# EAGLE design invader-rgb_working (EAGLE 7.5.0)
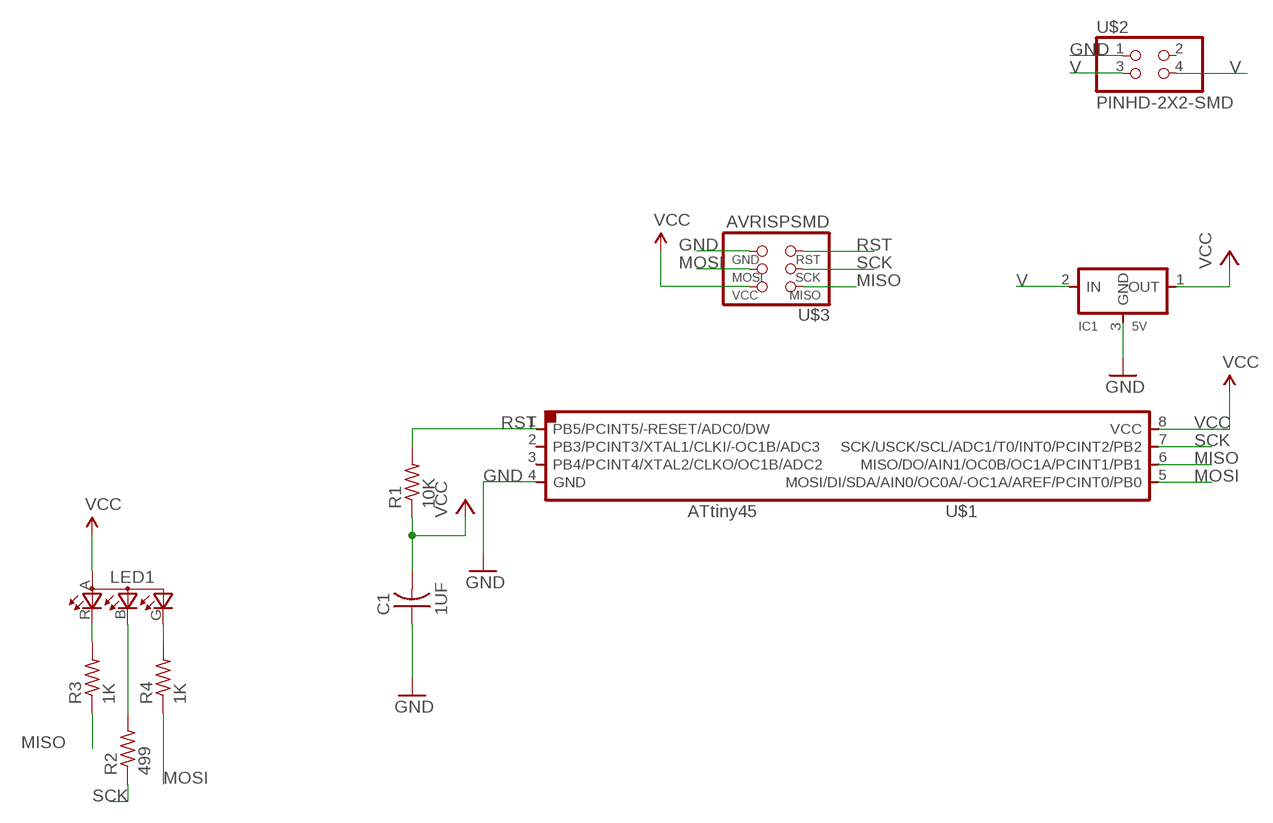
[diagram p0: schematic, sheet 1]

## Parts
C1  1UF  CAP-US1206FAB  [C1206FAB]
IC1  5V  REGULATORSOT23  [SOT23]
LED1  LEDRGBOLD  [P-LCC-4-3]
R1  10K  RES-US1206FAB  [R1206FAB]
R2  499  RES-US1206FAB  [R1206FAB]
R3  1K  RES-US1206FAB  [R1206FAB]
R4  1K  RES-US1206FAB  [R1206FAB]
U$1  ATTINY45SI  [SOIC8]
U$2  PINHD-2X2-SMD  [2X02SMD]
U$3  AVRISPSMD  [2X03SMD]

## Nets
GND: C1.1 IC1.3(GND) U$1.4(GND) U$2.1 U$3.6(GND)
MISO: R3.1 U$1.6(MISO/DO/AIN1/OC0B/OC1A/PCINT1/PB1) U$3.1(MISO)
MOSI: R4.1 U$1.5(MOSI/DI/SDA/AIN0/OC0A/-OC1A/AREF/PCINT0/PB0) U$3.4(MOSI)
N$1: LED1.R(CRED) R3.2
N$9: LED1.B(CBLUE) R2.2
N$11: LED1.G(CGREEN) R4.2
RST: R1.2 U$1.1(PB5/PCINT5/-RESET/ADC0/DW) U$3.5(RST)
SCK: R2.1 U$1.7(SCK/USCK/SCL/ADC1/T0/INT0/PCINT2/PB2) U$3.3(SCK)
V: IC1.2(IN) U$2.3 U$2.4
VCC: C1.2 IC1.1(OUT) LED1.A(A2) R1.1 U$1.8(VCC) U$3.2(VCC)
Unconnected: U$1.2(PB3/PCINT3/XTAL1/CLKI/-OC1B/ADC3) U$1.3(PB4/PCINT4/XTAL2/CLKO/OC1B/ADC2) U$2.2

## Library data of the parts
C1 = fab:CAP-US
IC1 = fab:REGULATOR
LED1 = fab:LEDRGBOLD: OSRAM Hyper Multi TOPLED® Hyper-Bright LED LATB T686 Source: http://www.osram.convergy.de/
R1-R4 = fab:RES-US: Resistor (US Symbol) Variants with postfix FAB are widened to allow the routing of internal traces
U$1 = fab:ATTINY45
U$2 = fab:PINHD-2X2-SMD
U$3 = fab:AVRISP

## Board
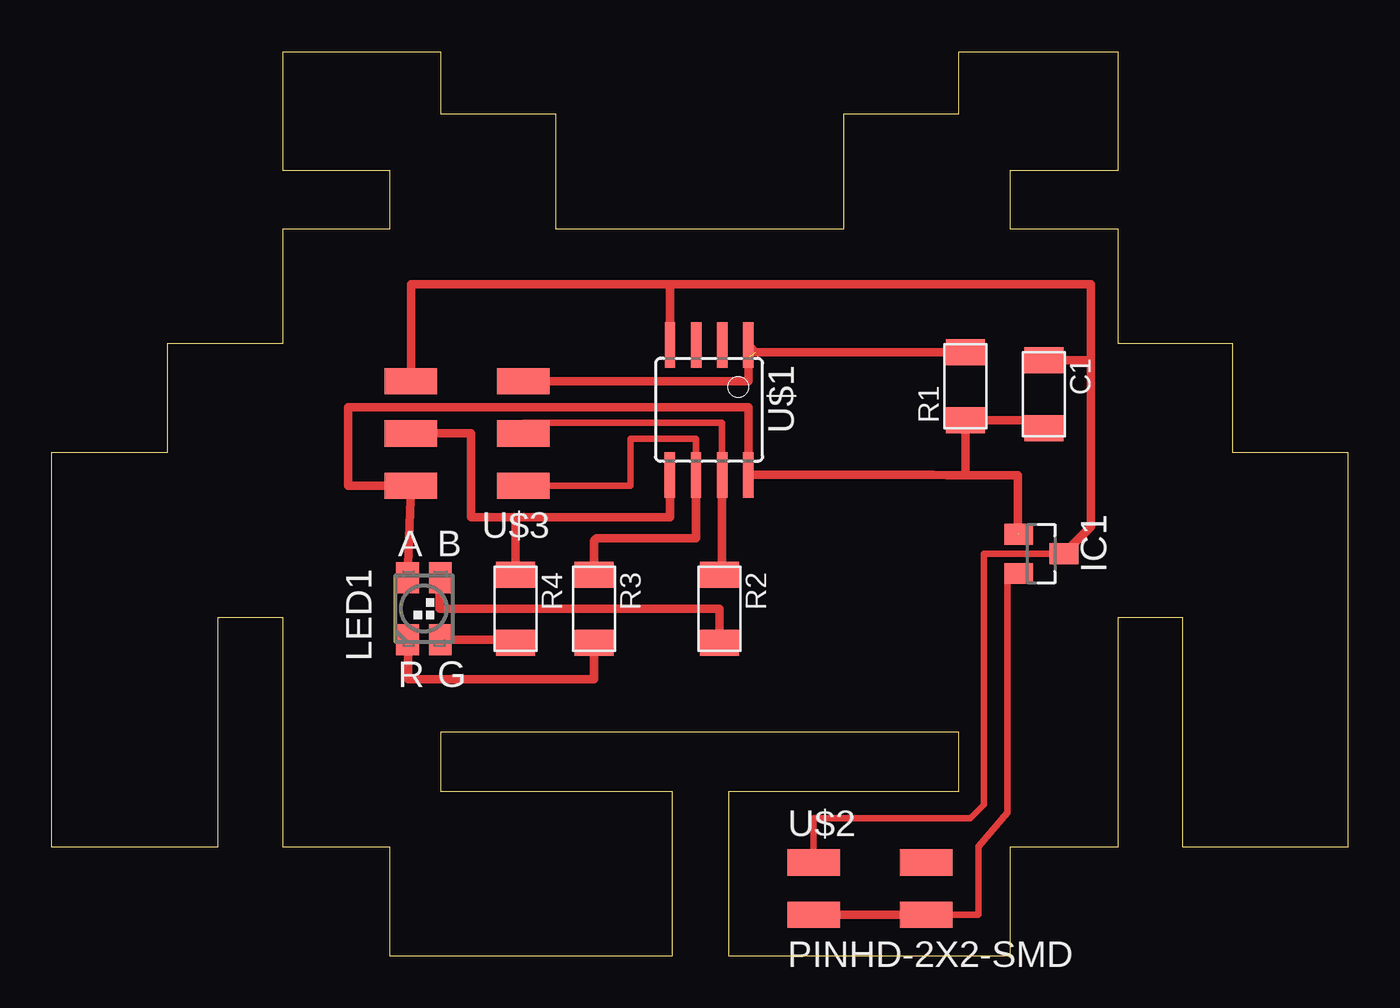
[diagram p1: board, top side]

Size 62.96 x 43.91 mm. Coordinates in mm from the lower left corner, seen from the top.
Outline: 16.45,5.27 11.24,5.27 11.24,16.41 8.06,16.41 8.06,5.27 0,5.27 0,24.45 5.65,24.45 5.65,29.75 11.24,29.75 11.24,35.31 16.45,35.31 16.45,38.13 11.24,38.13 11.24,43.91 18.89,43.91 18.89,40.89 24.48,40.89 24.48,35.31 38.48,35.31 38.48,40.89 44.07,40.89 44.07,43.91 51.78,43.91 51.78,38.13 46.55,38.13 46.55,35.31 51.78,35.31 51.78,29.75 57.34,29.75 57.34,24.45 62.96,24.45 62.96,5.27 54.93,5.27 54.93,16.41 51.78,16.41 51.78,5.27 46.55,5.27 46.55,0 32.89,0 32.89,8 44.07,8 44.07,10.86 18.89,10.86 18.89,8 30.13,8 30.13,0 16.45,0 16.45,5.27
Copper layers (1*16): Top 0.035mm / dielectric 1.5mm / Bottom 0.035mm
Design rules "default *": minimum track width 10mil, minimum drill 24mil, track to track 16mil, track to pad 16mil, pad to pad 16mil, via to via 16mil, smd to smd 16mil, copper to edge 40mil, drill to drill 8mil, minimum pad ring 10mil, minimum via ring 8mil, stop-mask expansion 4mil, vias tented up to drill 0mil, thermal gap 10mil

### Footprints (pad centres in the part's own frame; a part is rotated, then mirrored left to right if it is on the bottom)
C1206FAB = smd 1.27 x 1.905: 1 -1.651,0; 2 1.651,0
SOT23 = smd 1 x 1.4: 1 -0.95,-1.1; 2 0.95,-1.1; 3 0,1.1
P-LCC-4-3 = smd 1.1 x 1.5: A -0.8,1.5; B 0.8,1.5; G 0.8,-1.5; R -0.8,-1.5
R1206FAB = smd 1.27 x 1.905: 1 -1.651,0; 2 1.651,0
SOIC8 = smd 0.5 x 2.2: 1 -1.905,-3.154; 2 -0.645,-3.154; 3 0.625,-3.154; 4 1.895,-3.154; 5 1.905,3.154; 6 0.635,3.154; 7 -0.635,3.154; 8 -1.905,3.154
2X02SMD = smd 2.54 x 1.27: 1 -2.54,1.27; 2 2.92,1.27; 3 -2.54,-1.27; 4 2.92,-1.27
2X03SMD = smd 2.54 x 1.27: 1 -2.54,2.54; 2 2.92,2.54; 3 -2.54,0; 4 2.92,0; 5 -2.54,-2.54; 6 2.92,-2.54

### Placement (x,y rotation side)
C1  48.19,27.27 270 top
IC1  48.06,19.53 270 top
LED1  18.09,16.86 0 top
R1  44.38,27.66 90 top
R2  32.44,16.86 270 top
R3  26.35,16.86 270 top
R4  22.54,16.86 270 top
U$1  31.93,26.51 180 top
U$2  39.55,3.27 0 top
U$3  20.38,25.37 180 top

### Tracks (layer width: path | path; a pad name or v marks a point on that pad's centre or on a via)
GND
  Top 0.305: U$2.1 37.01,6.7 44.63,6.7 45.27,7.34 45.27,19.53 IC1.3
  Top 0.406: U$3.6 17.46,32.61 30.03,32.61 | 30.03,32.61 arc90 30.04,32.49 U$1.4 30.03,29.68 30.03,32.61 | IC1.3 50.48,20.84 50.48,29.05 | 50.48,29.05 50.35,28.93 C1.1 | 30.03,32.61 50.48,32.61 50.48,29.05
MISO
  Top 0.305: U$3.1 28.12,22.83 28.12,25.12 31.3,25.12 U$1.6
  Top 0.406: R3.1 26.35,20.16 26.47,20.29 31.3,20.29 U$1.6
MOSI
  Top 0.406: U$3.4 20.38,25.37 20.38,21.31 22.54,21.31 | 22.54,21.31 R4.1 | U$1.5 30.03,21.31 22.54,21.31
N$1
  Top 0.305: R3.2 25.96,15.21 25.96,15.34
  Top 0.406: LED1.R 17.31,14.83 17.33,15.21 17.33,13.43 26.35,13.43 arc-90 26.35,13.56 R3.2
N$9
  Top 0.406: LED1.B 18.85,18.32 18.85,16.86 32.44,16.86 R2.2
N$11
  Top 0.406: LED1.G 22.38,15.36 arc-90 R4.2
RST  (1 unrouted)
  Top 0.406: U$3.5 33.84,27.91 33.84,29.05 | U$1.1 34.2,29.31 R1.2
SCK
  Top 0.305: U$3.3 22.92,25.88 32.57,25.88 U$1.7
  Top 0.406: R2.1 32.57,18.64 U$1.7
V
  Top 0.305: U$2.4 45.01,2 45.01,5.3 46.41,6.95 46.41,18.38 | 46.41,18.64 46.41,18.38 | 46.41,18.38 IC1.2
  Top 0.406: U$2.3 U$2.4
VCC  (1 unrouted)
  Top 0.406: LED1.A U$3.2 | U$3.2 14.41,22.83 14.41,26.64 33.84,26.64 U$1.8 42.83,23.36 43.49,23.34 44.38,23.34 | 17.58,22.83 U$3.2 | C1.2 47.81,26 R1.1 44.38,23.34 | 46.92,20.52 46.92,23.34 44.38,23.34